# Altium schematic sheet socket.SchDoc
size A4
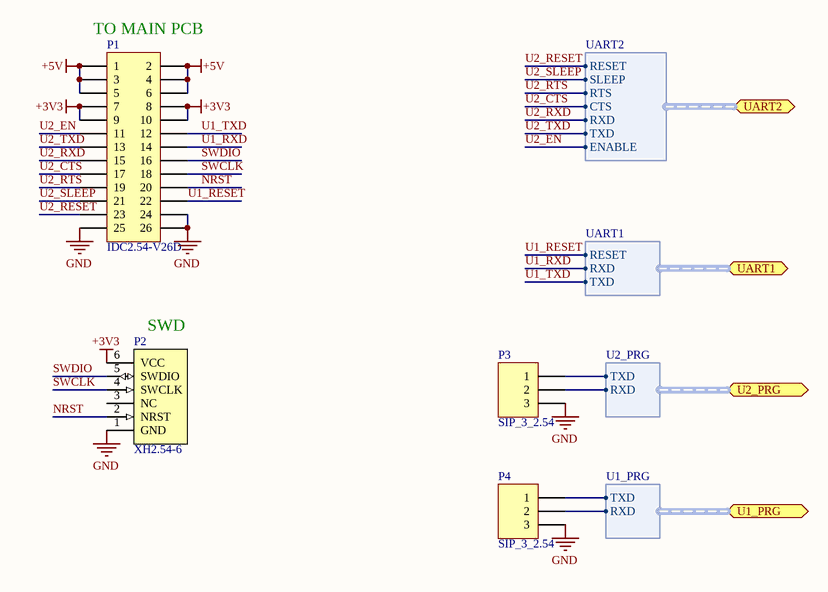
[diagram p0: socket.SchDoc]

## Parts
P1  IDC2.54-V26D  [IDC2.54-V26D]
P2  XH2.54-6  [REAL_SIP6_2.54]
P3  SIP_3_2.54  [REAL_SIP3_2.54]  (no BOM)
P4  SIP_3_2.54  [REAL_SIP3_2.54]  (no BOM)

## Ports
U1_PRG (harness U1_PRG), U2_PRG (harness U2_PRG), UART1 (harness UART1), UART2 (harness UART2)

## Harnesses
UART2: ENABLE, TXD, RXD, CTS, RTS, SLEEP, RESET
U2_PRG: TXD, RXD
UART1: TXD, RXD, RESET
U1_PRG: TXD, RXD

## Nets
+3V3: P1.7 P1.8 P1.9 P1.10 P2.6(VCC)
+5V: P1.1 P1.2 P1.3 P1.4 P1.5 P1.6
GND: P1.24 P1.25 P1.26 P2.1(GND) P3.3 P4.3
NRST: P1.20 P2.2(NRST)
SWCLK: P1.18 P2.4(SWCLK)
SWDIO: P1.16 P2.5(SWDIO)
U1_RESET: P1.22 ; port UART1.RESET
U1_RXD: P1.14 ; port UART1.RXD
U1_TXD: P1.12 ; port UART1.TXD
U2_CTS: P1.17 ; port UART2.CTS
U2_EN: P1.11 ; port UART2.ENABLE
U2_RESET: P1.23 ; port UART2.RESET
U2_RTS: P1.19 ; port UART2.RTS
U2_RXD: P1.15 ; port UART2.RXD
U2_SLEEP: P1.21 ; port UART2.SLEEP
U2_TXD: P1.13 ; port UART2.TXD
NetP3_1: P3.1 ; port U2_PRG.TXD
NetP3_2: P3.2 ; port U2_PRG.RXD
NetP4_1: P4.1 ; port U1_PRG.TXD
NetP4_2: P4.2 ; port U1_PRG.RXD

Not connected (* = marked no-connect by the designer): P2 3(NC)

## Notes on the sheet
- (near P1) TO MAIN PCB
- (near P2) SWD

## Library data of the parts
P1 = Header 13X2: IDC2.54-13x2 Header; LatestRevisionDate: 17-Jul-2002; LatestRevisionNote: Re-released for DXP Platform.; Publisher: Altium Limited; Price: 0.38
P2 = SWD-Connector: SW debug connector
P3 P4 = Header 3: Header, 3-Pin; LatestRevisionDate: 17-Jul-2002; LatestRevisionNote: Re-released for DXP Platform.; Publisher: Altium Limited